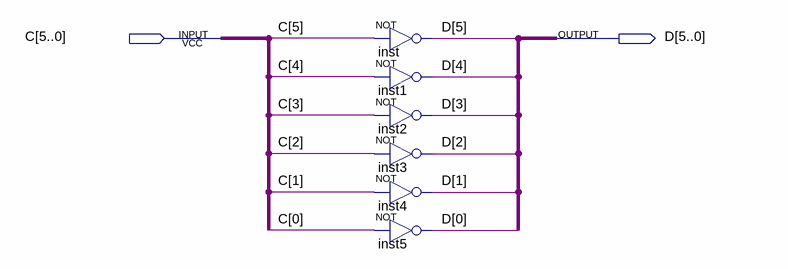
[diagram p0: schematic sheet]
// Quartus schematic invert.bdf as structural Verilog: 6 symbols, 2 pins
module invert (
  input  [5:0] C,
  output [5:0] D
);

  not inst (D[5], C[5]);
  not inst1 (D[4], C[4]);
  not inst2 (D[3], C[3]);
  not inst3 (D[2], C[2]);
  not inst4 (D[1], C[1]);
  not inst5 (D[0], C[0]);
endmodule
